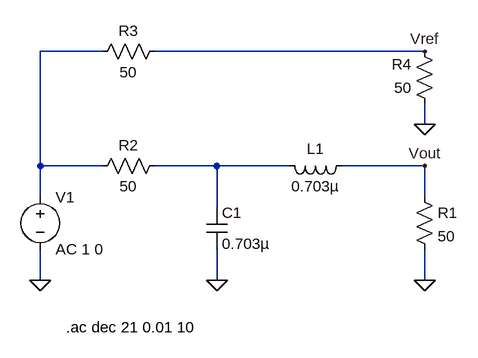
[diagram p0: schematic LCFilterScaled.asc]
LCFilterScaled.asc, the LTspice schematic file:
Version 4
SHEET 1 880 680
WIRE 224 192 128 192
WIRE 720 192 304 192
WIRE 720 304 720 272
WIRE 128 368 128 192
WIRE 224 368 128 368
WIRE 400 368 304 368
WIRE 512 368 400 368
WIRE 720 368 592 368
WIRE 128 416 128 368
WIRE 720 416 720 368
WIRE 400 432 400 368
WIRE 128 544 128 496
WIRE 400 544 400 496
WIRE 720 544 720 496
FLAG 128 544 0
FLAG 400 544 0
FLAG 720 544 0
FLAG 720 304 0
FLAG 720 368 Vout
FLAG 720 192 Vref
SYMBOL Voltage 128 400 R0
SYMATTR InstName V1
SYMATTR Value AC 1 0
SYMBOL Res 704 400 R0
SYMATTR InstName R1
SYMATTR Value 50
SYMBOL Res 320 352 R90
WINDOW 0 0 56 VBottom 2
WINDOW 3 32 56 VTop 2
SYMATTR InstName R2
SYMATTR Value 50
SYMBOL Res 320 176 R90
WINDOW 0 0 56 VBottom 2
WINDOW 3 32 56 VTop 2
SYMATTR InstName R3
SYMATTR Value 50
SYMBOL Res 736 288 R180
WINDOW 0 36 76 Left 2
WINDOW 3 36 40 Left 2
SYMATTR InstName R4
SYMATTR Value 50
SYMBOL Cap 384 432 R0
SYMATTR InstName C1
SYMATTR Value 0.703µ
SYMBOL Ind 608 352 R90
WINDOW 0 5 56 VBottom 2
WINDOW 3 32 56 VTop 2
SYMATTR InstName L1
SYMATTR Value 0.703µ
TEXT 168 616 Left 2 !.ac dec 21 0.01 10

The netlist it stands for:
* LCFilterScaled.asc
V1 N001 0 AC 1 0
R1 Vout 0 50
R2 N002 N001 50
R3 Vref N001 50
R4 0 Vref 50
C1 N002 0 0.703µ
L1 Vout N002 0.703µ
.ac dec 21 0.01 10
.backanno
.end